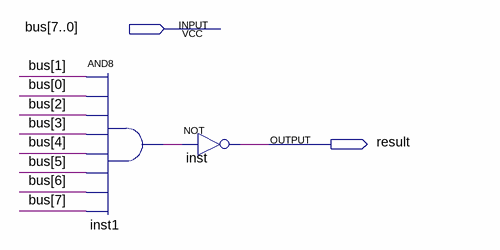
[diagram p0: schematic sheet]
// Quartus schematic NotAndForBusLines.bdf as structural Verilog: 2 symbols, 2 pins
module NotAndForBusLines (
  input  [7:0] bus,
  output result
);

  wire inst1_out;

  and inst1 (inst1_out, bus[1], bus[0], bus[2], bus[3], bus[4], bus[5], bus[6], bus[7]);
  not inst (result, inst1_out);
endmodule
